# Altium schematic sheet sheet2.SchDoc
size A; SheetNumber: 2; SheetTotal: 2
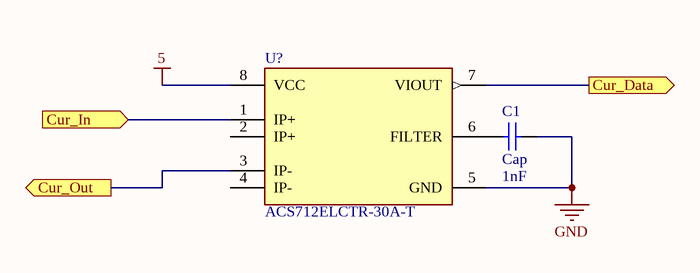
[diagram p0: sheet2.SchDoc]

## Parts
C1  Cap  value 1nF  [RAD-0.3]
U?  ACS712ELCTR-30A-T  [FP-LC-8-IPC_C]

## Ports
Cur_Data (out), Cur_In (in), Cur_Out (out)

## Nets
5: U?.8(VCC)
GND: C1.2 U?.5(GND)
Cur_Data: U?.7(VIOUT) ; port Cur_Data
Cur_In: U?.1(IP+) ; port Cur_In
Cur_Out: U?.3(IP-) ; port Cur_Out
NetC1_1: C1.1 U?.6(FILTER)

Not connected (* = marked no-connect by the designer): U? 2(IP+) 4(IP-)

## Library data of the parts
C1 = Cap: Capacitor; Published: 8-Jun-2000; LatestRevisionDate: 17-Jul-2002; LatestRevisionNote: Re-released for DXP Platform.; PackageReference: RAD-0.3; Publisher: Altium Limited; PackageDescription: Radial Cap, Thru-Hole; 2 Leads; 0.3 in Pin Spacing
U? = CMP-2000-04990-2: SENSOR CURRENT HALL 30A AC/DC; Bandwidth: 80kHz; Max Supply Current: 13mA; Linearity: 1.5%; Operating Supply Voltage: 5V; Quiescent Current: 10mA; Number of Channels: 1; Polarity: Bidirectional; Min Supply Voltage: 4.5V; Response Time: 5us; Sensitivity: 66mV/A; Max Supply Voltage: 5.5V; Current Sensing: 30A; REACH SVHC: No SVHC; Mount: Surface Mount; Max Operating Temperature: 85°C; Packaging: Cut Tape; Frequency: 80kHz; Series: -; Termination: SMD/SMT; RoHS Compliant: Yes; Number of Pins: 8; Package Quantity: 1; Accuracy: 1.5%; Lead Free: Lead Free; Case/Package: SOIC; Min Operating Temperature: -40°C; Output Current: 10mA